# EAGLE design 214_oled_Rev020000 (EAGLE 9.6.2)
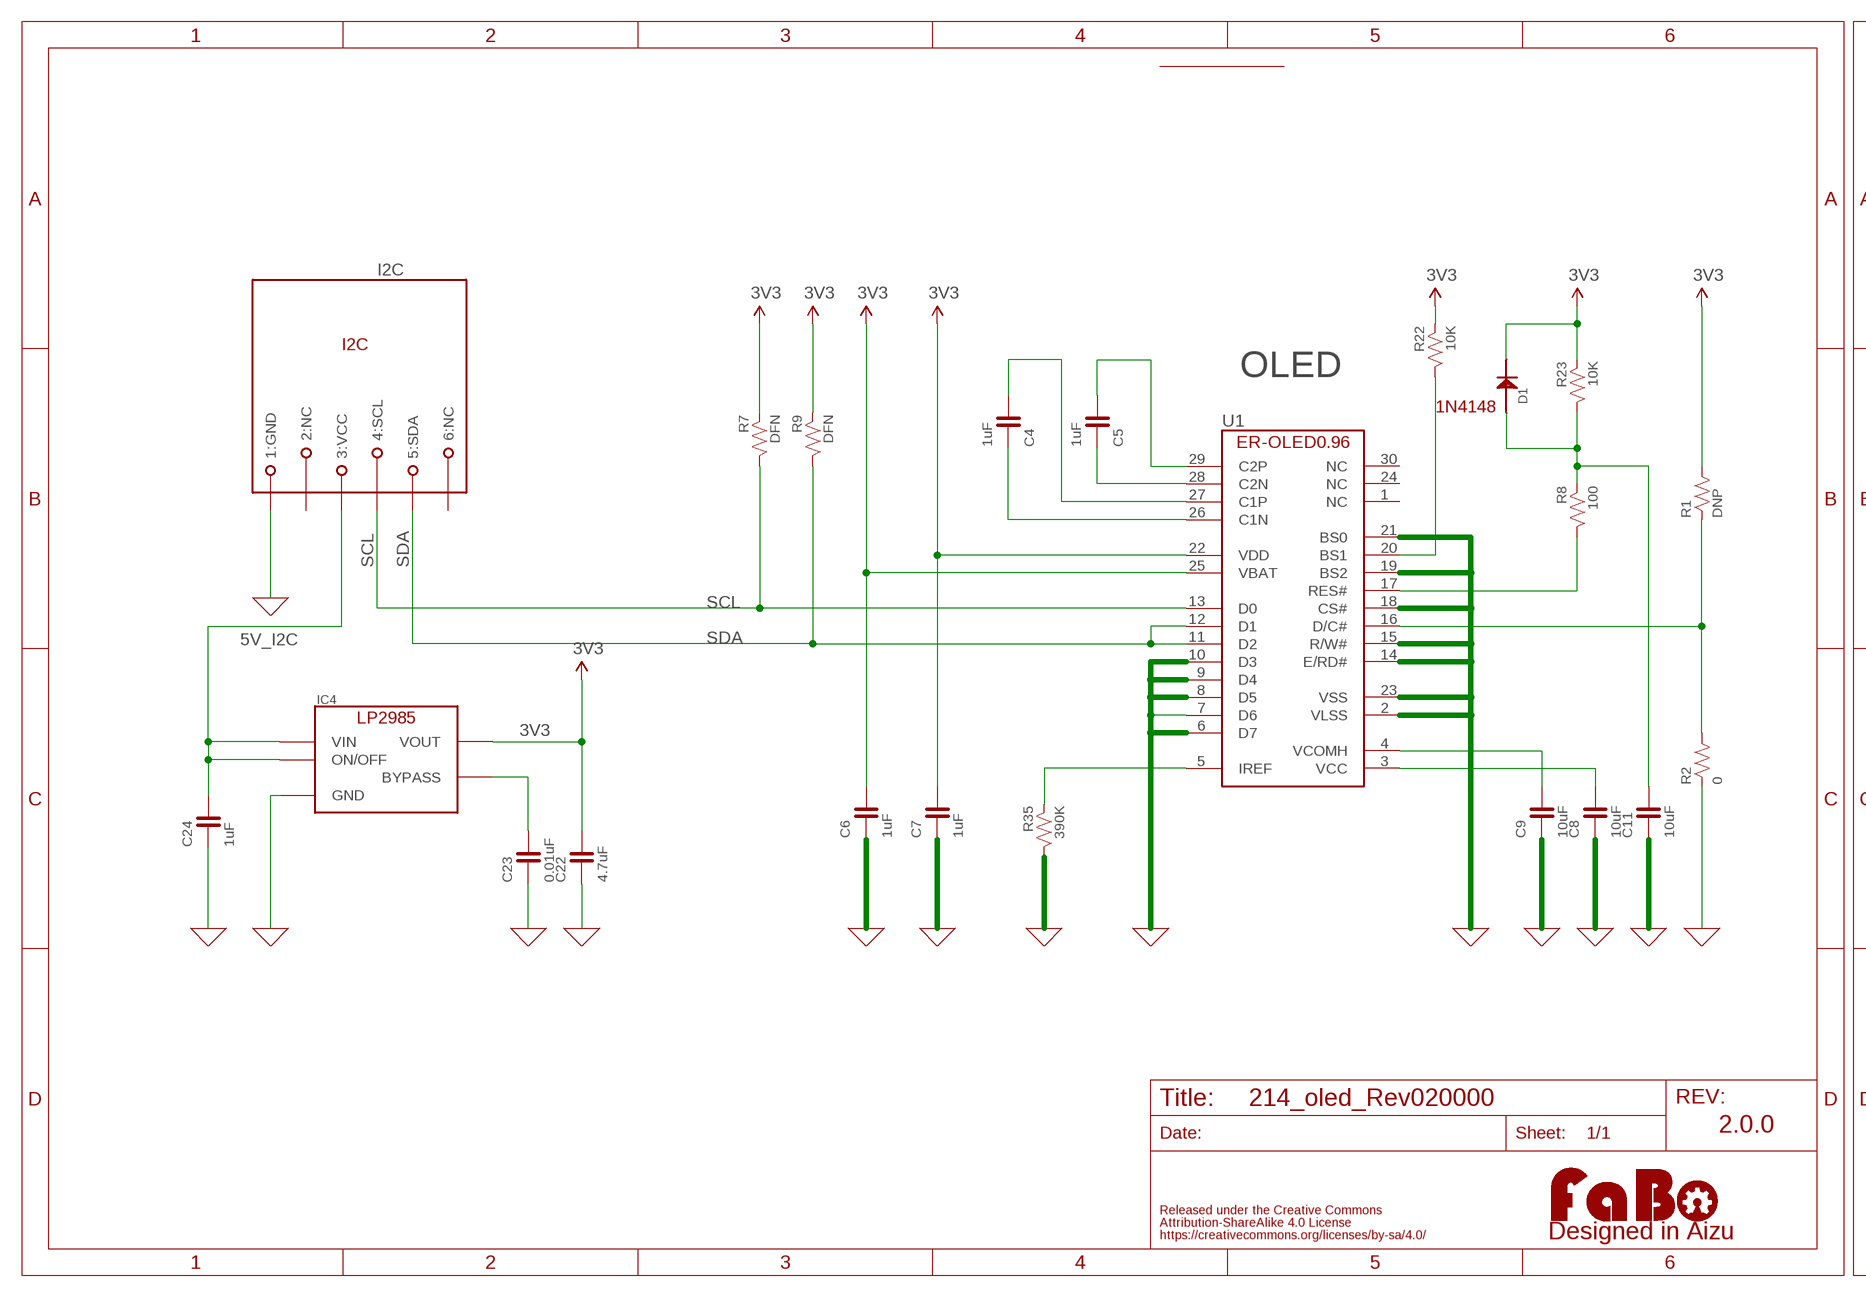
[diagram p0: schematic, sheet 1, part 1 of 2]
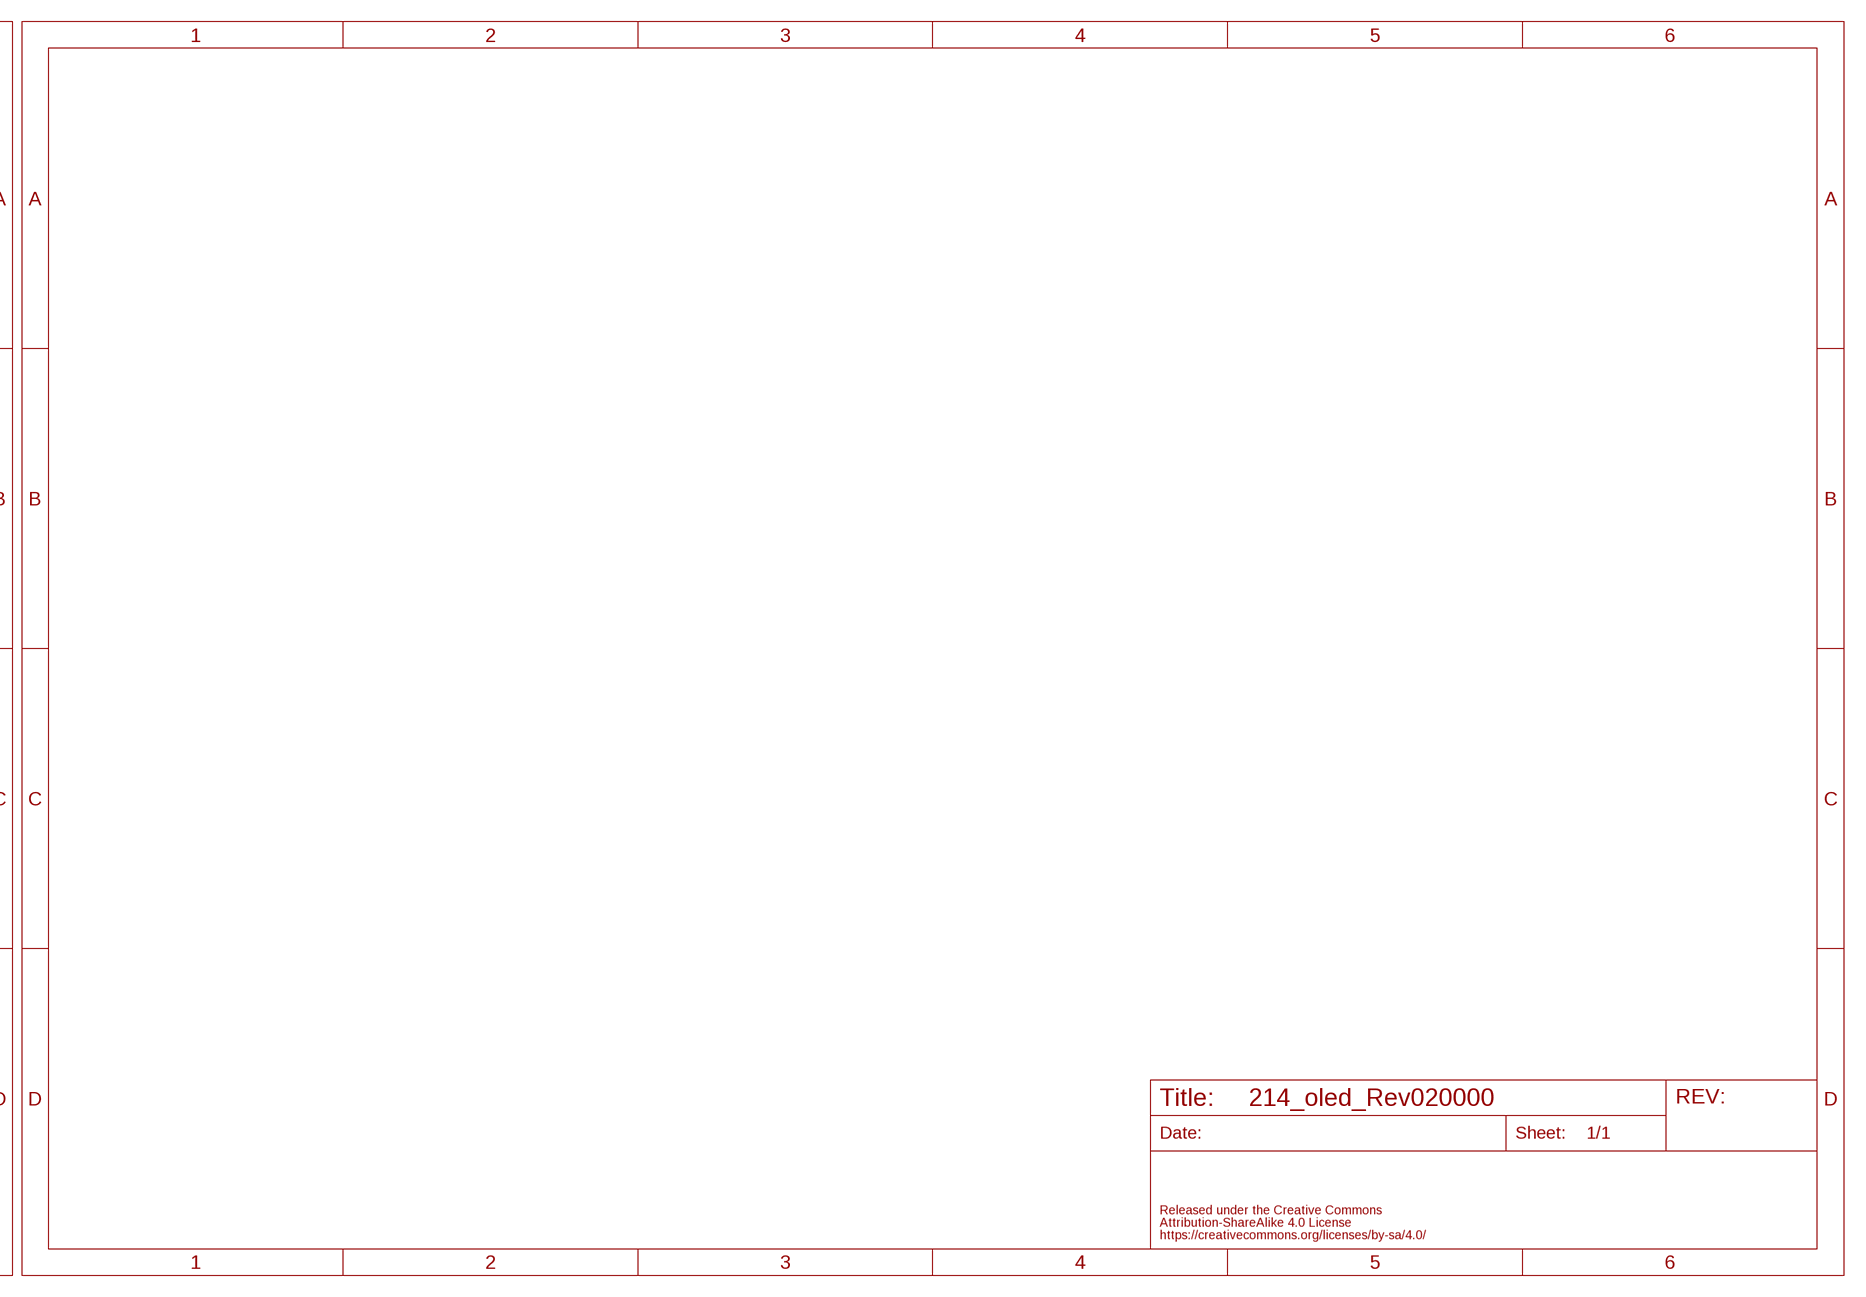
[diagram p1: schematic, sheet 1, part 2 of 2]

## Parts
C4  1uF  CAPACITOR-0603  [0603]
C5  1uF  CAPACITOR-0603  [0603]
C6  1uF  CAPACITOR-0603  [0603]
C7  1uF  CAPACITOR-0603  [0603]
C8  10uF  CAPACITOR-0603  [0603]
C9  10uF  CAPACITOR-0603  [0603]
C11  10uF  CAPACITOR-0603  [0603]
C22  4.7uF  CAPACITOR-0603  [0603]
C23  0.01uF  CAPACITOR-0603  [0603]
C24  1uF  CAPACITOR-0603  [0603]
D1  1N4148  [1N4148W]
I2C  MODULAR-JACK-6P-RJ11_I2C  [7002-6PXC-X]
IC4  LP2985-33DBV  [SOT-23-5]
LOGO1  LOGO_FABO-M_BOTTOM  [LOGO_FABO_M_BOTTOM]
R1  DNP  RESISTOR-0805  [0805]
R2  0  RESISTOR-0805  [0805]
R7  DFN  RESISTOR-0603  [0603]
R8  100  RESISTOR-0603  [0603]
R9  DFN  RESISTOR-0603  [0603]
R22  10K  RESISTOR-0603  [0603]
R23  10K  RESISTOR-0603  [0603]
R35  390K  RESISTOR-0603  [0603]
U1  ER-OLED0.96-1ER-CON30HT-1  [ER-CON30HT-1]

## Nets
0: C6.1 C7.1 C8.1 C9.1 C11.1 C22.1 C23.1 C24.1 I2C.1(1:GND) IC4.2(GND) R2.1 R35.2 U1.2(VLSS) U1.6(D7) U1.7(D6) U1.8(D5) U1.9(D4) U1.10(D3) U1.14(E/RD#) U1.15(R/W#) U1.18(CS#) U1.19(BS2) U1.21(BS0) U1.23(VSS) ; supply symbol labelled GND
3V3: C6.2 C7.2 C22.2 D1.CATHODE IC4.5(VOUT) R1.2 R7.1 R9.1 R22.1 R23.1 U1.22(VDD) U1.25(VBAT)
5V_I2C: C24.2 I2C.3(3:VCC) IC4.1(VIN) IC4.3(ON/OFF)
N$1: R1.1 R2.2 U1.16(D/C#)
N$2: C23.2 IC4.4(BYPASS)
N$16: C4.2 U1.27(C1P)
N$21: C4.1 U1.26(C1N)
N$22: C5.1 U1.28(C2N)
N$23: C5.2 U1.29(C2P)
N$24: R35.1 U1.5(IREF)
N$25: C9.2 U1.4(VCOMH)
N$26: C8.2 U1.3(VCC)
N$27: R8.2 U1.17(RES#)
N$28: C11.2 D1.ANODE R8.1 R23.2
N$50: R22.2 U1.20(BS1)
SCL: I2C.4(4:SCL) R7.2 U1.13(D0)
SDA: I2C.5(5:SDA) R9.2 U1.11(D2) U1.12(D1)
Unconnected: I2C.2(2:NC) I2C.6(6:NC) U1.1(NC) U1.24(NC) U1.30(NC)

## Notes on the sheet
- OLED
- 1N4148
- 2.0.0

## Library data of the parts
C4-C9 C11 C22-C24 = FaBo-Capacitor:CAPACITOR: CAPACITOR
D1 = FaBo-Diode:1N4148
I2C = FaBo-Connetor:MODULAR-JACK-6P-RJ11_I2C
IC4 = FaBo-Supply:LP2985: LP2985
LOGO1 = component:LOGO_FABO
R1 = FaBo-Resistors:RESISTOR: RESISTOR; SPICEPREFIX: R
R2 R7-R9 R22 R23 R35 = FaBo-Resistors:RESISTOR: RESISTOR
U1 = FaBo-Display:ER-OLED0.96-1

## Board
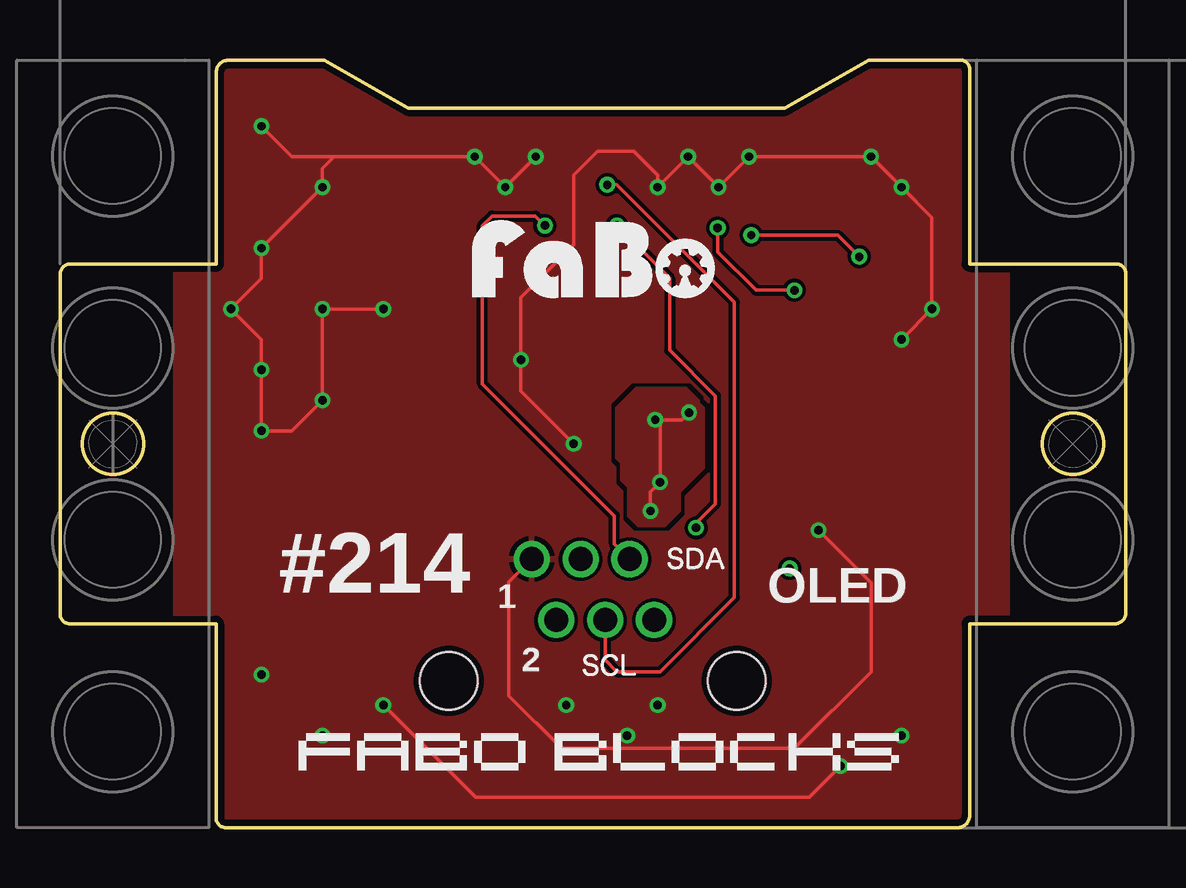
[diagram p2: board, top side]
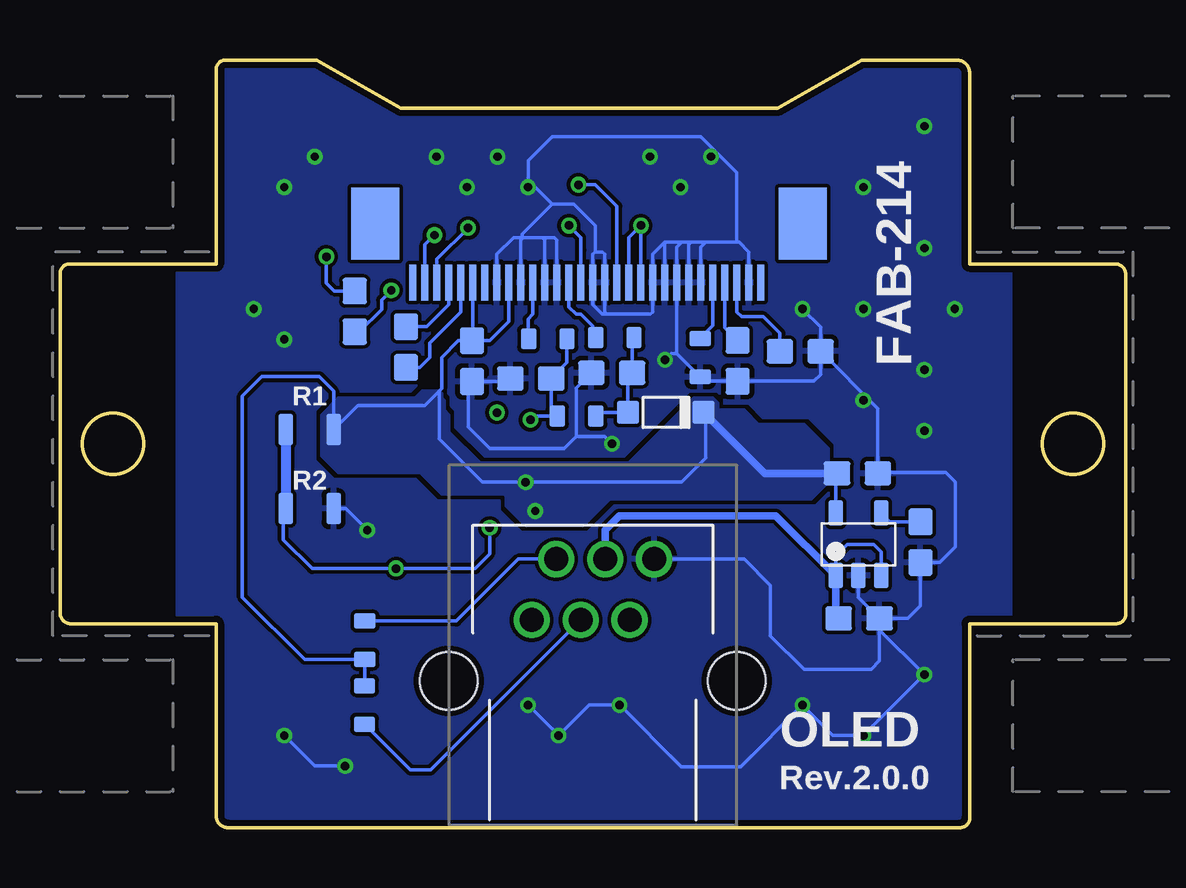
[diagram p3: board, bottom side, seen from below]

Size 44.41 x 32 mm. Coordinates in mm from the lower left corner, seen from the top.
Outline: 7.1,32 11,32 14.5,30 30.2,30 33.7,32 37.5,32 arc-90 37.9,31.6 37.9,23.5 44,23.5 arc-90 44.4,23.1 44.4,9 arc-90 44,8.5 37.9,8.5 37.9,0.5 arc-90 37.4,0 6.9,0 arc-90 6.5,0.4 6.5,8.5 0.4,8.5 arc-90 0,8.9 0,23 arc-90 0.4,23.5 6.5,23.5 6.5,31.5 arc-90 7.1,32
Outline: circle at 42.2,16 radius 1.27
Outline: circle at 2.2,16 radius 1.27
Copper layers (1*16): Top 0.035mm / dielectric 1.6mm / Bottom 0.035mm
Design rules "PCBway": minimum track width 6mil, minimum drill 12mil, track to track 6mil, track to pad 6mil, pad to pad 6mil, via to via 6mil, smd to smd 6mil, copper to edge 10mil, drill to drill 10mil, minimum pad ring 10mil, minimum via ring 6mil, stop-mask expansion 2mil, vias tented up to drill 100mil, thermal gap 8mil
tRestrict: area -1.2,7.3 to 4.7,24.4; area 39.6,7.5 to 45.5,24.6
bRestrict: area -1.2,7.3 to 4.7,24.4; area 39.6,7.6 to 45.5,24.7

### Footprints (pad centres in the part's own frame; a part is rotated, then mirrored left to right if it is on the bottom)
0603 = smd 1.1 x 1: 1 -0.85,0; 2 0.85,0
1N4148W = smd 0.9 x 0.95: ANODE 0,0; CATHODE 3.15,0
7002-6PXC-X = drill 1: 1 2.55,5.08; 2 1.53,2.54; 3 0.51,5.08; 4 -0.51,2.54; 5 -1.53,5.08; 6 -2.55,2.54 | hole 2.4: -6,0; 6,0
SOT-23-5 = smd 0.6 x 1.05: 1 -0.95,-1.3; 2 0,-1.3; 3 0.95,-1.3; 4 0.95,1.3; 5 -0.95,1.3
0805 = smd 0.6 x 1.3: 1 -1,0; 2 1,0
0603' = smd 0.65 x 0.9: 1 -0.8,0; 2 0.8,0
ER-CON30HT-1 = smd 0.3 x 1.5 bottom: 1 7,-0.23; 2 6.5,-0.23; 3 6,-0.23; 4 5.5,-0.23; 5 5,-0.23; 6 4.5,-0.23; 7 4,-0.23; 8 3.5,-0.23; 9 3,-0.23; 10 2.5,-0.23; 11 2,-0.23; 12 1.5,-0.23; 13 1,-0.23; 14 0.5,-0.23; 15 0,-0.23; 16 -0.5,-0.23; 17 -1,-0.23; 18 -1.5,-0.23; 19 -2,-0.23; 20 -2.5,-0.23; 21 -3,-0.23; 22 -3.5,-0.23; 23 -4,-0.23; 24 -4.5,-0.23; 25 -5,-0.23; 26 -5.5,-0.23; 27 -6,-0.23; 28 -6.5,-0.23; 29 -7,-0.23; 30 -7.5,-0.23 | smd 2 x 3 bottom: 31 -9.07,-2.67; 32 8.74,-2.67

### Placement (x,y rotation side)
C4  29.99,20.03 90 bottom
C5  32.12,21.52 90 bottom
C6  24.79,18.72 0 bottom
C7  27.24,19.45 90 bottom
C8  13.56,19.86 180 bottom
C9  16.17,19.46 90 bottom
C11  21.41,18.96 0 bottom
C22  11.18,14.77 180 bottom
C23  8.55,11.9 90 bottom
C24  11.11,8.72 180 bottom
D1  20.74,17.31 0 bottom
I2C  22.2,6.11 0 bottom
IC4  11.14,11.81 0 bottom
LOGO1  22.23,21.7 0 bottom
R1  34,16.6 0 bottom
R2  34,13.3 180 bottom
R7  DFN  [0603']  31.72,5.11 270 bottom
R8  100  [0603']  21.29,20.43 180 bottom
R9  DFN  [0603']  31.71,7.81 90 bottom
R22  10K  [0603']  24.08,20.38 180 bottom
R23  10K  [0603']  22.88,17.16 0 bottom
R35  390K  [0603']  17.74,19.59 270 bottom
U1  22.2,22.5 180 top
U$2  [4-1BLOCK]  2.2,16 0 top
U$4  [4-1BLOCK]  42.2,16 180 top

### Tracks (layer width: path | path; a pad name or v marks a point on that pad's centre or on a via)
0  (via drill 0.35)
  Top 0.152: v31.6,12.4 33.8,10.2 33.8,6.5 30.6,3.3 20.9,3.3 18.7,5.5 18.7,10.24 I2C.1 | v21.4,16 19.2,18.2 v19.2,19.5 19.2,22.1 21.4,24.3 21.4,27.2 22.4,28.2 23.9,28.2 24.9,27.2 v24.9,26.7 v26.17,27.97 v27.44,26.7 v28.71,27.97 v33.79,27.97 v35.06,26.7 36.33,25.43 v36.33,21.62 v35.06,20.35 | v32.52,2.57 31.22,1.27 17.31,1.27 v13.47,5.11 | v19.82,27.97 v18.55,26.7 v17.28,27.97 11.43,27.97 | 11.43,27.97 9.66,27.97 v8.39,29.24 | 11.43,27.97 10.93,27.47 v10.93,26.7 v8.39,24.16 8.39,22.89 v7.12,21.62 8.39,20.35 v8.39,19.08 v8.39,16.54 9.66,16.54 v10.93,17.81 v10.93,21.62 v13.47,21.62
  Bottom 0.152: 18.7,19.76 U1.8 18.7,24.2 18.5,24.4 | 18.7,19.76 R35.2 17.55,18.61 C9.1 12.99,18.61 12.71,18.89 C8.1 | C6.1 25.76,18.6 C7.1 27.4,18.44 27.4,16.7 26.5,15.8 23.4,15.8 22.9,16.3 | C11.1 22.9,18.32 22.9,16.3 | U1.2 15.7,24 16.1,24.4 16.2,24.4 | 16.2,24.4 17.5,24.4 | 17.5,24.4 17.7,24.2 U1.6 | U1.7 18.2,24.3 18.1,24.4 | 18.1,24.4 17.5,24.4 | 18.1,24.4 18.5,24.4 | 18.5,24.4 19.2,24.4 | 19.2,24.4 U1.9 | 19.2,24.4 19.7,23.9 U1.10 19.7,21.5 19.8,21.4 21.6,21.4 | U1.23 26.2,23.9 25.5,24.6 25.1,24.6 | 25.1,24.6 24.3,24.6 | 24.3,24.6 23.8,24.6 23.7,24.5 U1.18 | U1.19 24.2,24.5 24.3,24.6 | C24.1 9.08,8.72 8.55,9.25 C23.1 7.75,11.05 7.1,11.7 7.1,14.4 7.5,14.8 10.33,14.8 | C24.1 11.14,9.6 IC4.2 | 19.59,11.19 I2C.1 15.89,11.19 14.8,10.1 14.8,8 13.4,6.6 10.6,6.6 10.26,6.94 C24.1 | C22.1 10.33,14.8 | 10.33,14.8 10.33,17.48 C8.1 | 21.6,21.4 21.8,21.4 22.2,21.8 U1.15 22.2,23.9 22.1,24 | 21.6,21.4 21.7,21.5 U1.14 21.7,23.9 21.8,24 22.1,24 | R2.1 32.5,13.3 v31.6,12.4 | U1.21 25.2,24.5 25.15,24.55 | 25.15,24.55 25.1,24.6 | 25.15,24.55 25.15,24.75 23.9,26 | 23.9,26 23,26 22.1,25.1 22.1,24 | 23.9,26 24.6,26.7 v24.9,26.7 24.9,27.8 23.9,28.8 17.7,28.8 16.2,27.3 16.2,24.4 | 22.9,16.3 21.7,16.3 v21.4,16 | v19.2,19.5 18.94,19.76 18.7,19.76 | C24.1 10.26,8.25 v8.39,6.38 v10.93,3.84 12.2,3.84 v13.47,5.11 16.04,2.54 18.52,2.54 v21.09,5.11 22.36,5.11 v23.63,3.84 v24.9,5.11 | v32.52,2.57 33.79,2.57 v35.06,3.84 | C8.1 12.71,20.86 v13.47,21.62
  pour Bottom (rank 6): -4.48,-1.83 48.84,-1.83 48.84,34.63 -4.48,34.63
  pour Top (rank 6): -4.12,-1.1 47.41,-1.1 47.41,33.7 -4.12,33.7
3V3  (via drill 0.35)
  Top 0.152: v24.6,13.2 24.6,14 v25,14.4 25,16.8 v24.8,17 25.9,17 v26.2,17.3
  Bottom 0.152: C7.2 27.2,20.34 U1.25 | U1.22 25.7,21.1 26.51,20.3 C7.2 | R22.1 23.28,19.38 C6.2 23.94,17.42 R23.1 24.64,17.16 v24.8,17 | R7.1 31.72,7 R9.1 34.22,7.01 36.8,9.6 36.8,18 36,18.8 33.6,18.8 33,18.2 R1.2 32,17.6 29.2,17.6 28.6,18.2 | C7.2 27.81,20.3 28.5,19.6 28.5,18.3 28.6,18.2 | 28.6,18.2 28.6,16.2 26.8,14.4 v25,14.4 18.5,14.4 17.5,15.4 17.5,17.22 17.54,17.26 D1.CATHODE | IC4.5 12.09,14.71 C22.2
  Bottom 0.305: C22.2 15.05,14.77 17.54,17.26
  pour Top (no thermals): 23.2,15.4 23.2,17.5 24,18.3 26.1,18.3 26.6,17.8 26.6,17.7 26.8,17.5 26.8,15 25.8,14 25.8,13.2 25.2,12.6 24.1,12.6 23.7,13 23.7,14.2 23.4,14.5 23.4,15.2
  pour Bottom (no thermals): 12.4,14.4 12.4,15.8 13.4,16.8 15.3,16.8 15.9,17.4 17,17.4 17,17.7 17.2,17.9 18,17.9 20.7,15.2 26.9,15.2 28.2,16.5 28.2,17.2 28.4,17.4 28.4,17.8 28.5,17.9 28.5,18.1 28.6,18.2 29.3,18.2 29.6,17.9 32.8,17.9 33.5,17.2 33.5,15.5 32.8,14.8 29.4,14.8 28.5,13.9 25.9,13.9 25.8,13.8 25.8,13.4 25,12.6 22.6,12.6 21.5,13.7 13.1,13.7
5V_I2C
  Bottom 0.152: 12.02,8.78 C24.2 | IC4.3 10.19,11.48 10.5,11.8 11.6,11.8 12.09,11.31 IC4.1
  Bottom 0.305: I2C.3 21.69,12.41 21.1,13 14.58,13 IC4.1 12.09,8.85 12.02,8.78
N$1  (via drill 0.35)
  Top 0.152: v23.2,25.1 25.4,22.9 25.4,19.9 27.3,18 27.3,13.5 26.5,12.7 v26.5,12.5
  Bottom 0.152: U1.16 22.7,24.07 22.71,24.07 22.71,24.61 v23.2,25.1 | v26.5,12.5 26.5,11.4 27.1,10.8 v30.4,10.8 33.9,10.8 35.1,12 35.1,13.2 R2.2
  Bottom 0.406: R1.1 R2.2
N$2
  Bottom 0.152: C23.2 9.83,12.75 IC4.4
N$16
  Bottom 0.152: U1.27 28.2,21.8 29.12,20.88 C4.2
N$21
  Bottom 0.152: U1.26 27.7,21.5 29,20.2 29,19.6 29.42,19.18 C4.1
N$22  (via drill 0.35)
  Top 0.152: v27.4,25 27.4,24 29,22.4 v30.6,22.4
  Bottom 0.152: U1.28 28.7,23.7 v27.4,25 | v30.6,22.4 31,22 31,21.6 31.93,20.67 C5.1
N$23  (via drill 0.35)
  Top 0.152: v28.8,24.7 32.4,24.7 v33.3,23.8
  Bottom 0.152: U1.29 29.2,24.3 v28.8,24.7 | v33.3,23.8 33.3,22.7 32.97,22.37 C5.2
N$24
  Bottom 0.152: U1.5 17.2,20.93 R35.1
N$25
  Bottom 0.152: U1.4 16.7,20.84 C9.2
N$26
  Bottom 0.152: C8.2 14.41,20.61 15.1,21.3 16,21.3 16.2,21.5 U1.3
N$27
  Bottom 0.152: R8.2 22.2,20.54 22.2,20.9 22.7,21.4 22.9,21.4 23.2,21.7 U1.17
N$28
  Bottom 0.152: R8.1 20.56,20.36 C11.2 20.74,18.78 D1.ANODE 21.93,17.31 R23.2
N$50
  Bottom 0.152: U1.20 24.7,21.4 24.9,21.2 24.9,20.4 R22.2
SCL  (via drill 0.35)
  Top 0.152: I2C.4 22.71,6.99 23.2,6.5 25,6.5 28.1,9.6 28.1,21.9 23.2,26.8 v22.8,26.8
  Bottom 0.152: U1.13 21.2,25.9 22.1,26.8 v22.8,26.8 | R7.2 29.8,2.4 28.96,2.4 I2C.4
SDA  (via drill 0.35)
  Top 0.152: 23.7,11.22 I2C.5 23.1,11.82 23.1,13 17.6,18.5 17.6,25.1 18,25.5 19.8,25.5 v20.2,25.1
  Bottom 0.152: U1.11 v20.2,25.1 20.7,24.6 U1.12 | I2C.5 25.31,11.19 27.89,8.62 R9.2

### Text on the board
tPlace: #214 | 1 | OLED | 2
bPlace: FAB-214 | OLED | Rev.2.0.0
tDocu: #214 OLED for FaBo Blocks / 2023/01/20